# Altium schematic sheet IO.SchDoc
size A3; PageSetup: Record=PageOptions|CenterHorizontal=True|CenterVertical=True|PrintScale=1.28|XCorrection=1.00|YCorrection=1.00|PrintKind=0|BorderSize=5000000|LeftOffset=0|BottomOffset=0|Orientation=2|PaperLength=1000|PaperWidth=1000|Scale=100|PaperSource=7|PrintQuality=-4|MediaType=1|DitherType=10|PaperKind=A3 297x420mm|PrintScaleMode=1; Organization: Electronic Research & Design; Address1: 11 Granofier; Address2: Zwartkop; Address3: Centurion; Address4: South Africa
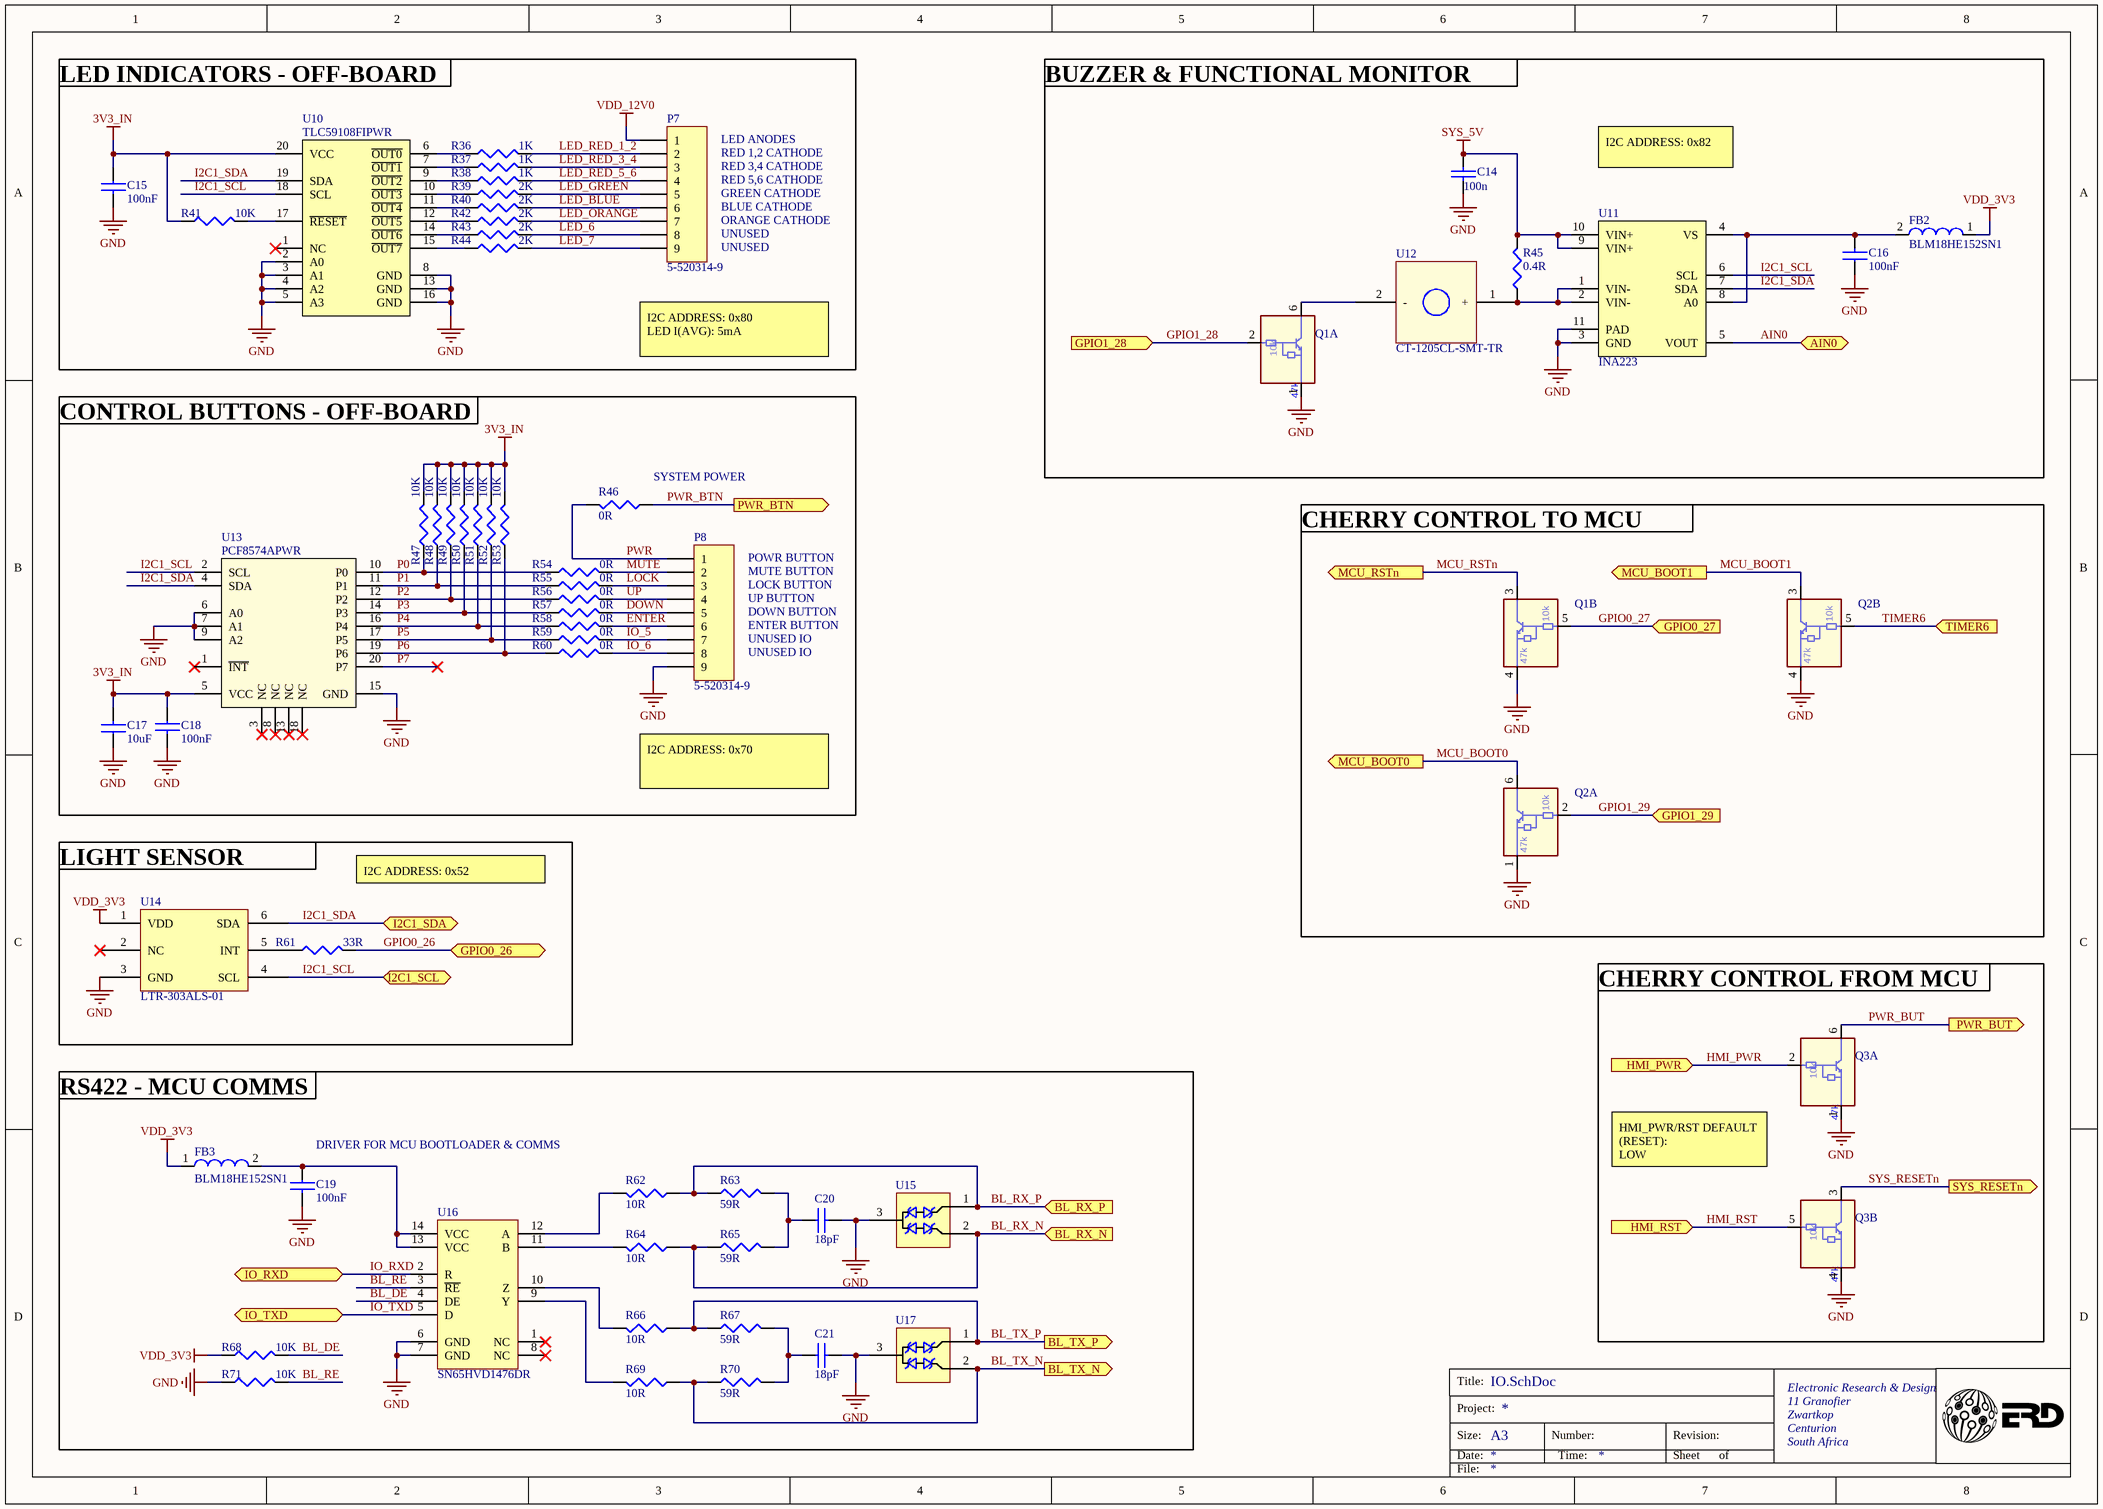
[diagram p0: IO.SchDoc]

## Parts
C14  Comment_1: 100n  [CC0402]  (hidden comment: 100nF)
C15  100nF  [CC0402]
C16  100nF  [CC0402]
C17  10uF  [CC0603]
C18  100nF  [CC0402]
C19  100nF  [CC0402]
C20  18pF  [CC0402]
C21  18pF  [CC0402]
FB2  BLM18HE152SN1  [LC0603]
FB3  BLM18HE152SN1  [LC0603]
P7  5-520314-9  [HDR1X9]
P8  5-520314-9  [HDR1X9]
Q1  DDC114YU-7-F  [SMini6-F3-B]  (value not drawn)  (parts A,B of 2)
Q2  DDC114YU-7-F  [SMini6-F3-B]  (value not drawn)  (parts A,B of 2)
Q3  DDC114YU-7-F  [SMini6-F3-B]  (value not drawn)  (parts A,B of 2)
R36  1K  [RC0402]
R37  1K  [RC0402]
R38  1K  [RC0402]
R39  2K  [RC0402]
R40  2K  [RC0402]
R41  10K  [RC0402]
R42  2K  [RC0402]
R43  2K  [RC0402]
R44  2K  [RC0402]
R45  0.4R  [RC1210]
R46  0R  [RC0402]
R47  10K  [RC0402]
R48  10K  [RC0402]
R49  10K  [RC0402]
R50  10K  [RC0402]
R51  10K  [RC0402]
R52  10K  [RC0402]
R53  10K  [RC0402]
R54  0R  [RC0402]
R55  0R  [RC0402]
R56  0R  [RC0402]
R57  0R  [RC0402]
R58  0R  [RC0402]
R59  0R  [RC0402]
R60  0R  [RC0402]
R61  33R  [RC0402]
R62  10R  [RC0603]
R63  59R  [RC0402]
R64  10R  [RC0603]
R65  59R  [RC0402]
R66  10R  [RC0603]
R67  59R  [RC0402]
R68  10K  [RC0402]
R69  10R  [RC0603]
R70  59R  [RC0402]
R71  10K  [RC0402]
U10  TLC59108FIPWR  [TSSOP-20]
U11  INA223
U12  CT-1205CL-SMT-TR
U13  PCF8574APWR  [TSSOP-20]
U14  LTR-303ALS-01  [LTR-303]
U15  TPD2E007DCKR  [SOT23 - DGK]  (value not drawn)
U16  SN65HVD1476DR  [SOIC-14]
U17  TPD2E007DCKR  [SOT23 - DGK]  (value not drawn)

## Blocks framed on the sheet
DRIVER FOR MCU BOOTLOADER & COMMS: C19-C21 FB3 R62-R71 U15-U17

## Ports
AIN0, BL_RX_N (in), BL_RX_P (in), BL_TX_N (out), BL_TX_P (out), GPIO0_26, GPIO0_27 (in), GPIO1_28 (in), GPIO1_29 (in), HMI_PWR (in), HMI_RST (in), I2C1_SCL, I2C1_SDA, IO_RXD, IO_TXD, MCU_BOOT0 (out), MCU_BOOT1 (out), MCU_RSTn (out), PWR_BTN (out), PWR_BUT (out), SYS_RESETn (out), TIMER6 (in)

## Nets
3V3_IN: C15.1 C17.2 C18.1 R41.1 R47.2 R48.2 R49.2 R50.2 R51.2 R52.2 R53.2 U10.20(VCC) U13.5(VCC)
GND: C14.1 C15.2 C16.1 C17.1 C18.2 C19.2 C20.2 C21.2 P8.9 Q1.1 Q1.4 Q2.1 Q2.4 Q3.1 Q3.4 R71.1 U10.2(A0) U10.3(A1) U10.4(A2) U10.5(A3) U10.8(GND) U10.13(GND) U10.16(GND) U11.3(GND) U11.11(PAD) U13.6(A0) U13.7(A1) U13.9(A2) U13.15(GND) U14.3(GND) U15.3(GND) U16.6(GND) U16.7(GND) U17.3(GND)
SYS_5V: C14.2 R45.1 U11.9(VIN+) U11.10(VIN+)
VDD_3V3: FB2.1 FB3.1 R68.1 U14.1(VDD)
VDD_12V0: P7.1
AIN0: U11.5(VOUT) ; port AIN0
BL_DE: R68.2 U16.4(DE)
BL_RE: R71.2 U16.3(~{RE})
BL_RX_N: R64.1 R65.1 U15.2(IO2) ; port BL_RX_N
BL_RX_P: R62.1 R63.1 U15.1(IO1) ; port BL_RX_P
BL_TX_N: R69.1 R70.1 U17.2(IO2) ; port BL_TX_N
BL_TX_P: R66.1 R67.1 U17.1(IO1) ; port BL_TX_P
DOWN: P8.5 R57.2
ENTER: P8.6 R58.2
GPIO0_26: R61.2 ; port GPIO0_26
GPIO0_27: Q1.5 ; port GPIO0_27
GPIO1_28: Q1.2 ; port GPIO1_28
GPIO1_29: Q2.2 ; port GPIO1_29
HMI_PWR: Q3.2 ; port HMI_PWR
HMI_RST: Q3.5 ; port HMI_RST
I2C1_SCL: U10.18(SCL) U11.6(SCL) U13.2(SCL) U14.4(SCL) ; port I2C1_SCL
I2C1_SDA: U10.19(SDA) U11.7(SDA) U13.4(SDA) U14.6(SDA) ; port I2C1_SDA
IO_5: P8.7 R59.2
IO_6: P8.8 R60.2
IO_RXD: U16.2(R) ; port IO_RXD
IO_TXD: U16.5(D) ; port IO_TXD
LED_6: P7.8 R43.2
LED_7: P7.9 R44.2
LED_BLUE: P7.6 R40.2
LED_GREEN: P7.5 R39.2
LED_ORANGE: P7.7 R42.2
LED_RED_1_2: P7.2 R36.2
LED_RED_3_4: P7.3 R37.2
LED_RED_5_6: P7.4 R38.2
LOCK: P8.3 R55.2
MCU_BOOT0: Q2.6 ; port MCU_BOOT0
MCU_BOOT1: Q2.3 ; port MCU_BOOT1
MCU_RSTn: Q1.3 ; port MCU_RSTn
MUTE: P8.2 R54.2
P0: R47.1 R54.1 U13.10(P0)
P1: R48.1 R55.1 U13.11(P1)
P2: R49.1 R56.1 U13.12(P2)
P3: R50.1 R57.1 U13.14(P3)
P4: R51.1 R58.1 U13.16(P4)
P5: R52.1 R59.1 U13.17(P5)
P6: R53.1 R60.1 U13.19(P6)
P7: U13.20(P7)
PWR: P8.1 R46.2
PWR_BTN: R46.1 ; port PWR_BTN
PWR_BUT: Q3.6 ; port PWR_BUT
SYS_RESETn: Q3.3 ; port SYS_RESETn
TIMER6: Q2.5 ; port TIMER6
UP: P8.4 R56.2
NetC16_2: C16.2 FB2.2 U11.4(VS) U11.8(A0)
NetC19_1: C19.1 FB3.2 U16.13(VCC) U16.14(VCC)
NetC20_1: C20.1 R63.2 R65.2
NetC21_1: C21.1 R67.2 R70.2
NetQ1_6: Q1.6 U12.2(-)
NetR36_1: R36.1 U10.6(~{OUT0})
NetR37_1: R37.1 U10.7(~{OUT1})
NetR38_1: R38.1 U10.9(~{OUT2})
NetR39_1: R39.1 U10.10(~{OUT3})
NetR40_1: R40.1 U10.11(~{OUT4})
NetR41_2: R41.2 U10.17(~{RESET})
NetR42_1: R42.1 U10.12(~{OUT5})
NetR43_1: R43.1 U10.14(~{OUT6})
NetR44_1: R44.1 U10.15(~{OUT7})
NetR45_2: R45.2 U11.1(VIN-) U11.2(VIN-) U12.1(+)
NetR61_1: R61.1 U14.5(INT)
NetR62_2: R62.2 U16.12(A)
NetR64_2: R64.2 U16.11(B)
NetR66_2: R66.2 U16.10(Z)
NetR69_2: R69.2 U16.9(Y)

Not connected (* = marked no-connect by the designer): U10 1(NC)*; U13 1(~{INT})* 3(NC)* 8(NC)* 13(NC)* 18(NC)*; U14 2(NC)*; U16 1(NC)* 8(NC)*

## Notes on the sheet
- LED INDICATORS - OFF-BOARD
- BUZZER & FUNCTIONAL MONITOR
- LED ANODES
- RED 1,2 CATHODE
- RED 3,4 CATHODE
- RED 5,6 CATHODE
- I2C ADDRESS: 0x82
- GREEN CATHODE
- BLUE CATHODE
- ORANGE CATHODE
- UNUSED
- I2C ADDRESS: 0x80
  LED I(AVG): 5mA
- CONTROL BUTTONS - OFF-BOARD
- (near R46) SYSTEM POWER
- POWR BUTTON
- MUTE BUTTON
- LOCK BUTTON
- CHERRY CONTROL TO MCU
- UP BUTTON
- DOWN BUTTON
- ENTER BUTTON
- UNUSED IO
- I2C ADDRESS: 0x70
- LIGHT SENSOR
- I2C ADDRESS: 0x52
- (near Q3) CHERRY CONTROL FROM MCU
- RS422 - MCU COMMS
- (near Q3) HMI_PWR/RST DEFAULT (RESET):
  LOW
- Title:
- Size:
- Date:
- Project:
- A3
- Number:
- Time:
- Revision:
- Sheet
- of
- File:
- (in symbol RN1907, part A) 10k; 47k
- (in symbol RN1907, part B) 10k; 47k

## Library data of the parts
C14 = CAPCERAMIC: Capacitor, Ceramic; Text Field1: Yageo; Text Field2: Phillips; Tolerance: ±20%; Dielectric: X7R; Voltage: 25V; Current: *; Wattage: *; Part Number: *
C15 C16 C18 C19 = CAP CER 0.1UF 10V 10% X5R 0402: CAP CER 0.1UF 50V 10% X7R 0402; Manufacturer: Murata; PartNumber: GCM155R71H104KE02D; Package / Case: 0402 (1005 Metric); Supplier: AAD
C17 = CAP CER 0.1UF 10V 10% X5R 0402: CAP CER 10UF 25V 20% X5R 0603; Manufacturer: Murata; PartNumber: GRM188R61E106MA73D; Package / Case: 0603; Supplier: AAD
C20 C21 = CAP CER 2.2UF 6.3V 10% X5R 0402: CAP CER 18pF 50V 5% C0G 0402; Manufacturer: AVX; PartNumber: GJM1555C1H180FB01D; Package / Case: 0402 (1005 Metric); Supplier: AAD; Supplier Stock Code: N/A
FB2 FB3 = FER_180_200_0: FERRITE, 500mA, 500mOHM, 0603; PartNumber: BLM18HE152SN1
P7 P8 = Header 9: FPC Connector, 9-circuit, 2.54mm pitch, RA, TH; Manufacturer: TE; PartNumber: 5-520314-9
Q1-Q3 = RN1907: TRANS PREBIASED DUAL NPN SOT363; Manufacturer: Diodes Inc; Manufacturer Part Number: DDC114YU-7-F; Package / Case: 6-TSSOP, SC-88, SOT-363; Supplier: AAD; Supplier Stock Code: N/A
R36-R38 = RES_10K_1/16W_1%_0402: RES, 1K OHM, 1/16W, 1%, 0402; Manufacturer: Yageo; PartNumber: RC0402FR-071KL; Package / Case: 0402 (1005 Metric); Supplier: AAD
R39 R40 R42-R44 = RES_10K_1/16W_1%_0402: RES, 2K OHM, 1/16W, 1%, 0402; Manufacturer: Yageo; PartNumber: RC0402FR-072KL; Package / Case: 0402 (1005 Metric); Supplier: AAD
R41 R68 R71 = RES_10K_1/16W_1%_0402: RES, 10K OHM, 1/16W, 1%, 0402; Manufacturer: Yageo; Part Number: RC0402FR-0710KL; Package / Case: 0402 (1005 Metric); Supplier: AAD
R45 = RES_10K_1/16W_1%_0402: RES, 0.4 OHM, 1/2W, 1%, 2010; Manufacturer: Yageo; PartNumber: WSL2010R4000FEA; Package / Case: 2010
R46 R54-R60 = RES_10K_1/16W_1%_0402: RES, 0 OHM, 1/16W, 1%, 0402; Manufacturer: Yageo; PartNumber: RC0402FR-070RL; Package / Case: 0402 (1005 Metric); Supplier: AAD
R47-R53 = RES_10K_1/16W_1%_0402: RES, 10K OHM, 1/16W, 1%, 0402; Manufacturer: Yageo; PartNumber: RC0402FR-0710KL; Package / Case: 0402 (1005 Metric); Supplier: AAD
R61 = RES_10K_1/16W_1%_0402: RES, 33 OHM, 1/16W, 1%, 0402; Manufacturer: Yageo; PartNumber: RC0402FR-0733RL; Package / Case: 0402 (1005 Metric); Supplier: AAD
R62 R64 R66 R69 = RES_10K_1/16W_1%_0402: RES 10 OHM 1/10W 5% 0603 SMD; Manufacturer: Yageo; PartNumber: RC0603JR-0710RL; Package / Case: 0402 (1005 Metric); Supplier: AAD; Supplier Stock Code: YAGA-80461
R63 R65 R67 R70 = RES_10K_1/16W_1%_0402: RES, 59 OHM, 1/16W, 1%, 0402; Manufacturer: Yageo; PartNumber: RC0402FR-0759RL; Package / Case: 0402 (1005 Metric); Supplier: AAD
U10 = TLC59108F: LED Driver, 8-Channel, I2C, TSSOP-20; PartNumber: TLC59108FIPWR
U11 = INA223: Power Monitor, I2C, SON-10; PartNumber: INA223
U12 = CT-1205CL-SMT: CUI CT-1205CL-SMT-TR Buzzer; PartNumber: CT-1205CL-SMT-TR
U13 = PCF8574APWR: IO Expander, I2C, 8-bit, TSSOP-20; Manufacturer: Texas Instruments; PartNumber: PCF8574APWR
U14 = LTR-303ALS-01: LIGHT SENSOR
U15 U17 = TPD2E007: DIODE, TVS, 2-CHANNEL ESD PROTECTION ARRAY, SOT23; Manufacturer: Texas Instruments; PartNumber: TPD2E007DCKR; Supplier: Digikey; Supplier Part Number: 296-24599-2-ND
U16 = SN65HVD1476: Transceiver, RS-485/422, Full-Duplex, SOIC-14; PartNumber: SN65HVD1476DR